# Altium schematic sheet power.SchDoc
size A3
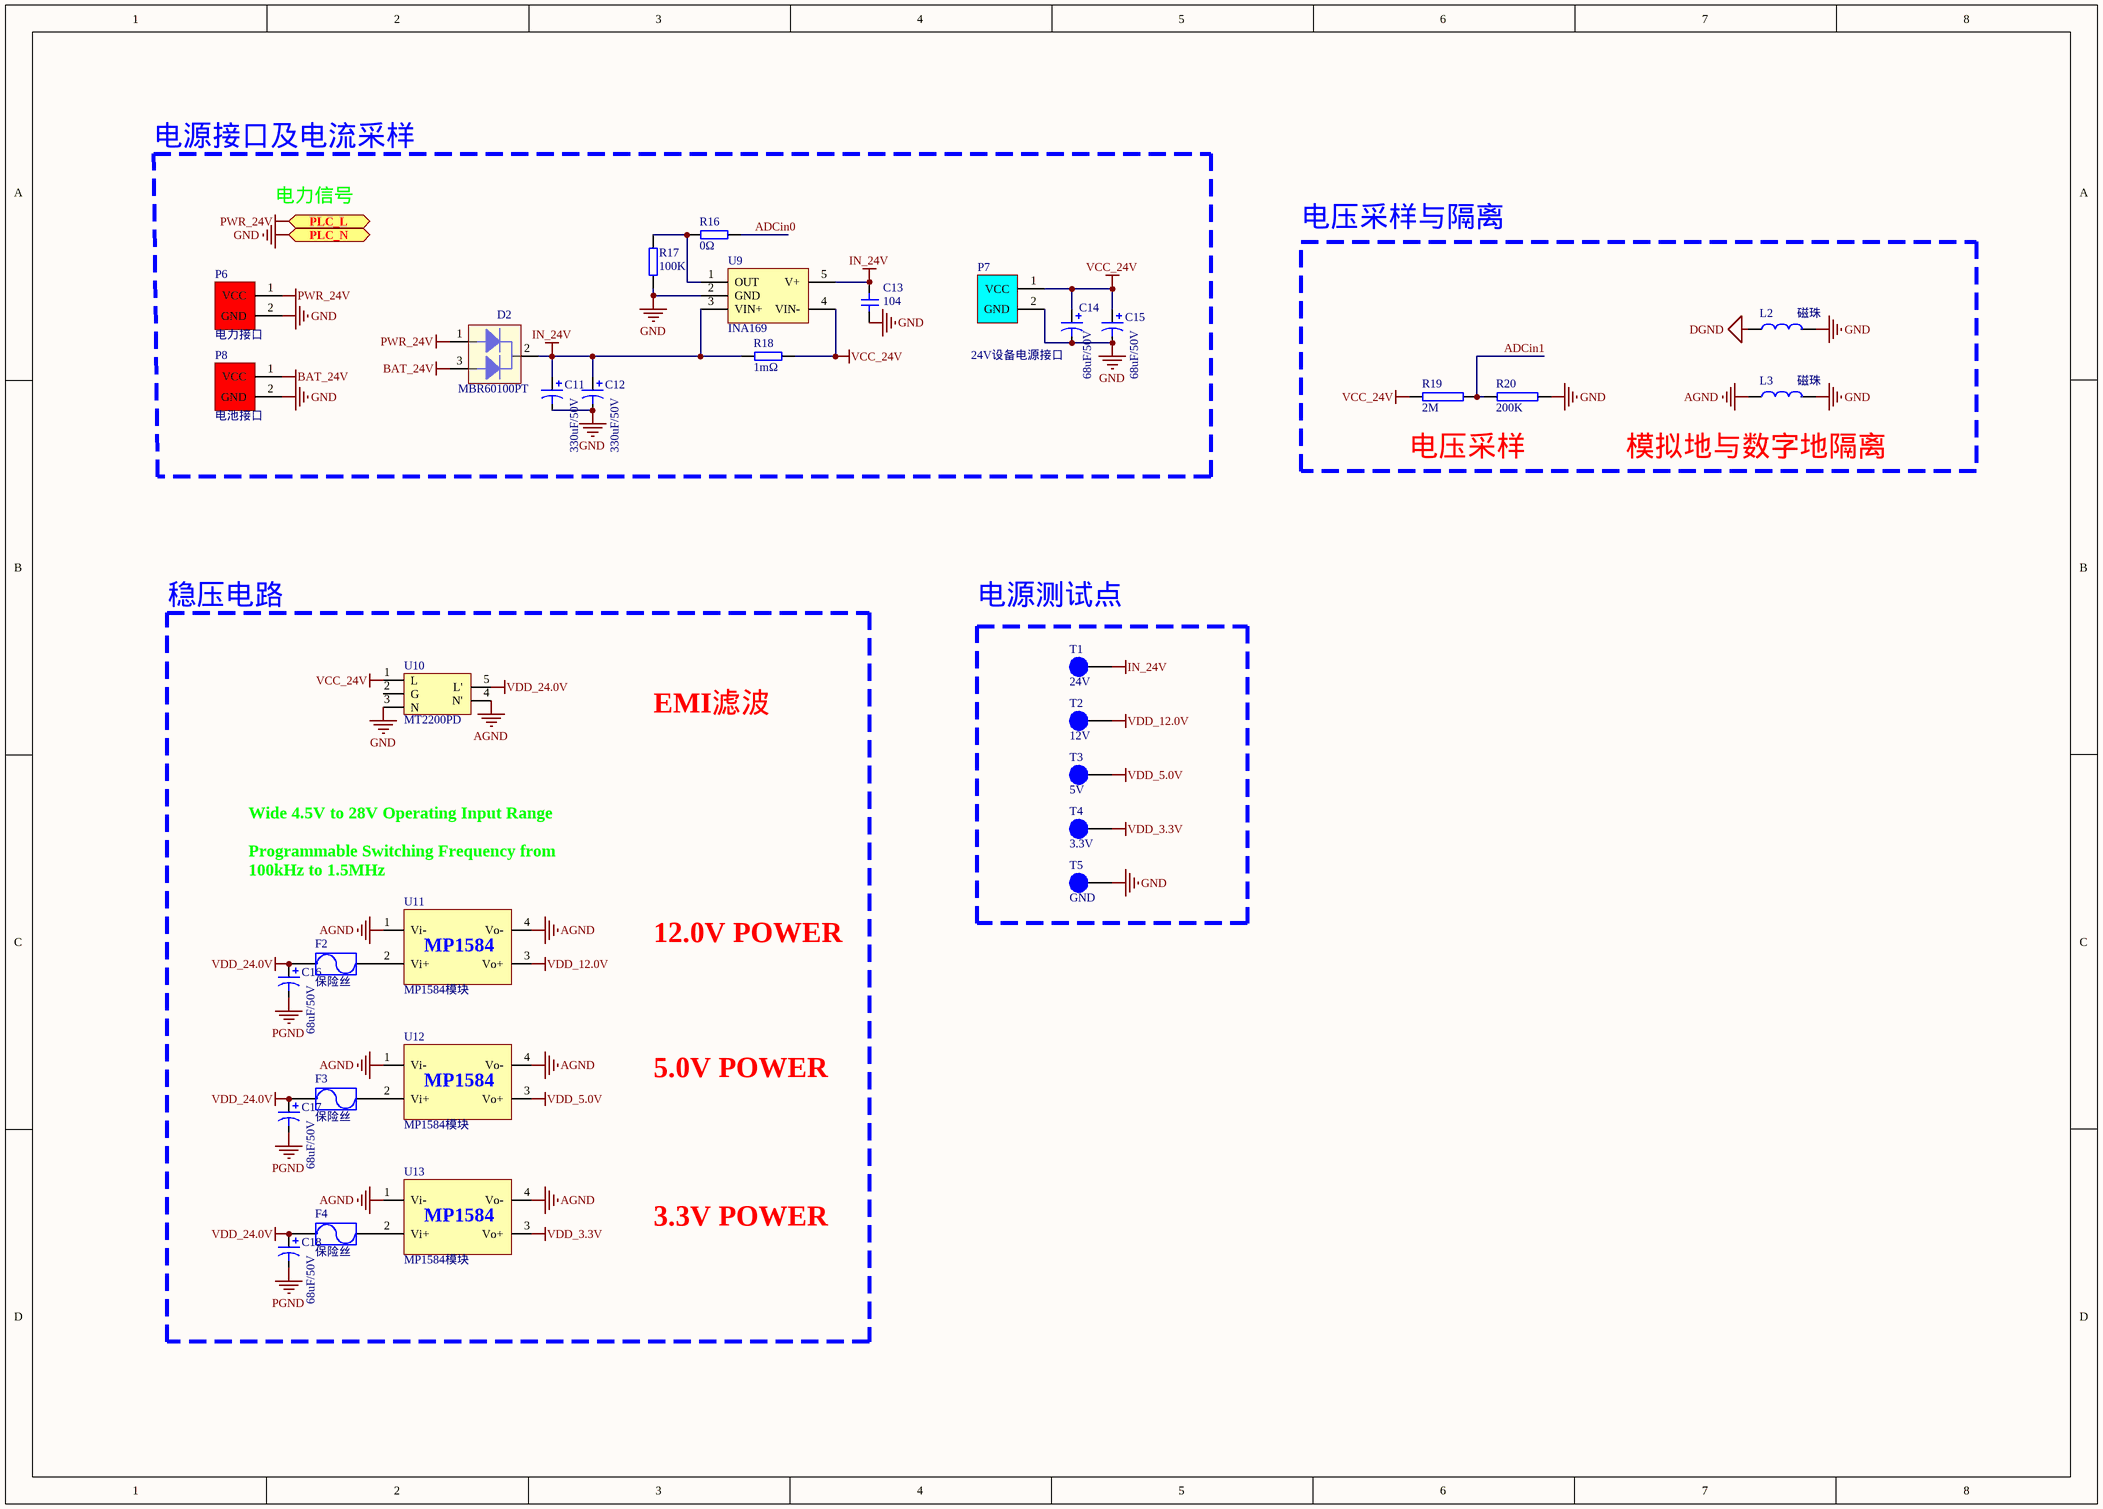
[diagram p0: power.SchDoc]

## Parts
C11  330uF/50V  [RB.2.4]
C12  330uF/50V  [RB.2.4]
C13  104  [0805C]
C14  68uF/50V  [RB.1.2]
C15  68uF/50V  [RB.1.2]
C16  68uF/50V  [RB.1.2]
C17  68uF/50V  [RB.1.2]
C18  68uF/50V  [RB.1.2]
D2  MBR60100PT  [TO-247LS]
F2  保险丝  [FUSE-1812]
F3  保险丝  [FUSE-1812]
F4  保险丝  [FUSE-1812]
L2  磁珠  [1206L]
L3  磁珠  [1206L]
P6  电力接口  [XT60-F]
P7  24V设备电源接口  [XT60-F]
P8  电池接口  [XT60-F]
R16  0Ω  [0805R]
R17  100K  [0805R]
R18  1mΩ  [2512R]
R19  2M  [0805R]
R20  200K  [0805R]
T1  24V  [HEADER 1]
T2  12V  [HEADER 1]
T3  5V  [HEADER 1]
T4  3.3V  [HEADER 1]
T5  GND  [HEADER 1]
U9  INA169  [SOT23-5]
U10  MT2200PD  [MT2200PD-6A]
U11  MP1584模块  [MP1584电源模块]
U12  MP1584模块  [MP1584电源模块]
U13  MP1584模块  [MP1584电源模块]

## Blocks framed on the sheet
电源接口及电流采样: C11-C15 D2 P6-P8 R16-R18 U9
电源测试点: T1-T5

## Ports
PLC_L, PLC_N

## Nets
AGND: L3.1 U10.4(N') U11.1(Vi-) U11.4(Vo-) U12.1(Vi-) U12.4(Vo-) U13.1(Vi-) U13.4(Vo-)
BAT_24V: D2.3 P8.1(VCC)
DGND: L2.1
GND: C11.2 C12.2 C13.1 C14.2 C15.2 L2.2 L3.2 P6.2(GND) P7.2(GND) P8.2(GND) R17.1 R20.2 T5.1 U9.2(GND) U10.3(N) ; port PLC_N
IN_24V: C11.1 C12.1 C13.2 D2.2 R18.2 T1.1 U9.3(VIN+) U9.5(V+)
PGND: C16.2 C17.2 C18.2
PWR_24V: D2.1 P6.1(VCC) ; port PLC_L
VCC_24V: C14.1 C15.1 P7.1(VCC) R18.1 R19.1 U9.4(VIN-) U10.1(L)
VDD_3.3V: T4.1 U13.3(Vo+)
VDD_5.0V: T3.1 U12.3(Vo+)
VDD_12.0V: T2.1 U11.3(Vo+)
VDD_24.0V: C16.1 C17.1 C18.1 F2.1 F3.1 F4.1 U10.5(L')
ADCin0: R16.1
ADCin1: R19.2 R20.1
NetF2_2: F2.2 U11.2(Vi+)
NetF3_2: F3.2 U12.2(Vi+)
NetF4_2: F4.2 U13.2(Vi+)
NetR16_2: R16.2 R17.2 U9.1(OUT)

Not connected (* = marked no-connect by the designer): U10 2(G)

## Notes on the sheet
- 电力信号
- 电压采样与隔离
- 电压采样
- (near L3) 模拟地与数字地隔离
- 稳压电路
- EMI滤波
- (near U11) Wide 4.5V to 28V Operating Input Range
  Programmable Switching Frequency from
  100kHz to 1.5MHz
- 12.0V POWER
- 5.0V POWER
- 3.3V POWER
- (in symbol MP1584电源模块) MP1584

## Library data of the parts
C11 C12 C14-C18 = Cap3: 直插极性电容
C13 = Cap1: 无极贴片电容
F2-F4 = Fuse
L2 L3 = L: 电感
P6 P8 = 电源端子
P7 = 推进器电源
R16-R18 = Res: 电阻
R19 R20 = R1
T1-T5 = 测试点
U11-U13 = MP1584电源模块